# EAGLE design power electronics8 (EAGLE 9.2.2)
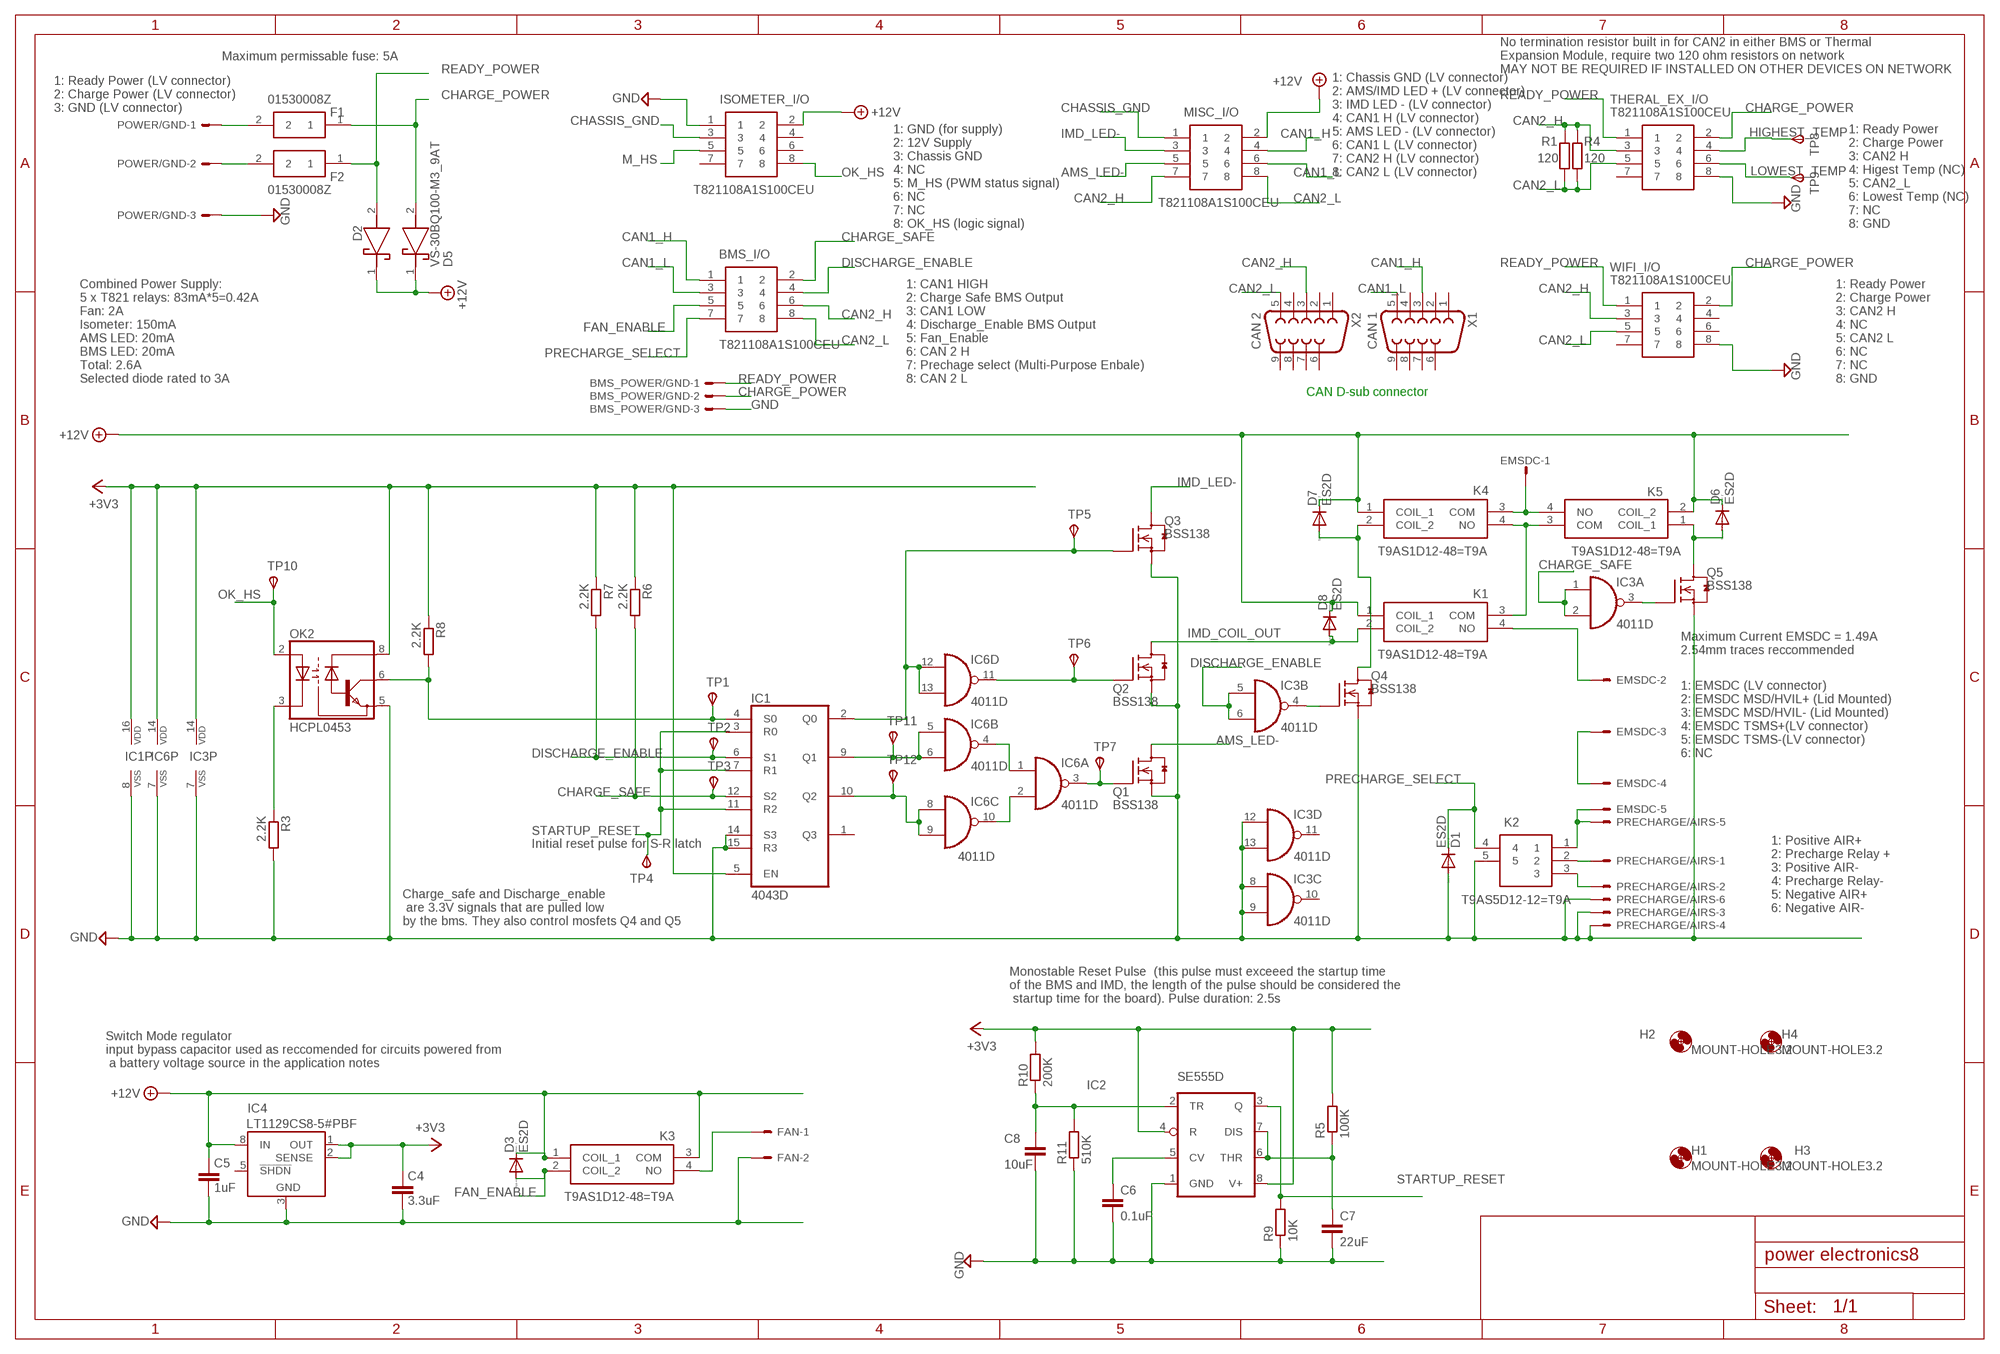
[diagram p0: schematic, sheet 1]

## Parts
BMS_I/O  T821108A1S100CEU  [HDRV8W64P254_2X4_1778X895X915P]
BMS_POWER/GND  KK-156-3  [KK-156-3]
C4  3.3uF  C-EUC1206  [C1206]
C5  1uF  C-EUC1206  [C1206]
C6  0.1uF  C-EUC1206  [C1206]
C7  22uF  C-EUC1206  [C1206]
C8  10uF  C-EUC1206  [C1206]
D1  ES2D  [SMB]
D2  VS-30BQ100-M3_9AT  [DIOM7959X262N]
D3  ES2D  [SMB]
D5  VS-30BQ100-M3_9AT  [DIOM7959X262N]
D6  ES2D  [SMB]
D7  ES2D  [SMB]
D8  ES2D  [SMB]
EMSDC  KK-156-6  [KK-156-6]
F1  01530008Z  [01530008]
F2  01530008Z  [01530008]
FAN  KK-156-2  [KK-156-2]
H1  MOUNT-HOLE3.2  [3,2]
H2  MOUNT-HOLE3.2  [3,2]
H3  MOUNT-HOLE3.2  [3,2]
H4  MOUNT-HOLE3.2  [3,2]
IC1  4043D  [SO16]
IC2  SE555D  [SO08]
IC3  4011D  [SO14]
IC4  LT1129CS8  [SOIC8]
IC6  4011D  [SO14]
ISOMETER_I/O  T821108A1S100CEU  [HDRV8W64P254_2X4_1778X895X915P]
K1  T9AS1D12-48=T9A  [T9AS1D1248T9A]
K2  T9AS5D12-12=T9A  [T9AS1D12]
K3  T9AS1D12-48=T9A  [T9AS1D1248T9A]
K4  T9AS1D12-48=T9A  [T9AS1D1248T9A]
K5  T9AS1D12-48=T9A  [T9AS1D1248T9A]
MISC_I/O  T821108A1S100CEU  [HDRV8W64P254_2X4_1778X895X915P]
OK2  HCPL0453  [SOIC08]
POWER/GND  KK-156-3  [KK-156-3]
PRECHARGE/AIRS  KK-156-6  [KK-156-6]
Q1  BSS138  [SOT23]
Q2  BSS138  [SOT23]
Q3  BSS138  [SOT23]
Q4  BSS138  [SOT23]
Q5  BSS138  [SOT23]
R1  120  R-EU_R1206  [R1206]
R3  2.2K  R-EU_R1206  [R1206]
R4  120  R-EU_R1206  [R1206]
R5  100K  R-EU_R1206  [R1206]
R6  2.2K  R-EU_R1206  [R1206]
R7  2.2K  R-EU_R1206  [R1206]
R8  2.2K  R-EU_R1206  [R1206]
R9  10K  R-EU_R1206  [R1206]
R10  200K  R-EU_R1206  [R1206]
R11  510K  R-EU_R1206  [R1206]
THERAL_EX_I/O  T821108A1S100CEU  [HDRV8W64P254_2X4_1778X895X915P]
TP1  TPSTP11R  [TP11R]
TP2  TPSTP11R  [TP11R]
TP3  TPSTP11R  [TP11R]
TP4  TPSTP11R  [TP11R]
TP5  TPSTP11R  [TP11R]
TP6  TPSTP11R  [TP11R]
TP7  TPSTP11R  [TP11R]
TP8  TPSTP11R  [TP11R]
TP9  TPSTP11R  [TP11R]
TP10  TPSTP11R  [TP11R]
TP11  TPSTP11R  [TP11R]
TP12  TPSTP11R  [TP11R]
WIFI_I/O  T821108A1S100CEU  [HDRV8W64P254_2X4_1778X895X915P]
X1  CAN 1  F09V  [F09V]
X2  CAN 2  F09V  [F09V]

## Nets
+3V3: C4.1 IC1.5(EN) IC1.16(VDD) IC2.4(R) IC2.8(V+) IC3.14(P:VDD) IC4.1(OUT) IC4.2(SENSE) IC6.14(P:VDD) OK2.8(VCC) R5.2 R6.1 R7.1 R8.1 R10.2
+12V [power]: C5.1 D2.1(K) D3.C D5.1(K) D6.C D7.C D8.C IC4.8(IN) ISOMETER_I/O.2 K1.1(COIL_1) K3.1(COIL_1) K3.3(COM) K4.1(COIL_1) K5.2(COIL_2) MISC_I/O.2
AMS_LED-: MISC_I/O.5 Q1.3(D)
CAN1_H: BMS_I/O.1 MISC_I/O.4 X1.3
CAN1_L: BMS_I/O.3 MISC_I/O.6 X1.5
CAN2_H: BMS_I/O.6 MISC_I/O.7 R1.1 R4.1 THERAL_EX_I/O.3 WIFI_I/O.3 X2.3
CAN2_L: BMS_I/O.8 MISC_I/O.8 R1.2 R4.2 THERAL_EX_I/O.5 WIFI_I/O.5 X2.5
CHARGE_POWER [power]: BMS_POWER/GND.2 D5.2(A) F1.1 THERAL_EX_I/O.2 WIFI_I/O.2
CHARGE_SAFE: BMS_I/O.2 IC1.12(S2) IC3.1(A:I0) IC3.2(A:I1) R6.2 TP3.TP(PP)
CHASSIS_GND [GND]: ISOMETER_I/O.3 MISC_I/O.1
DISCHARGE_ENABLE: BMS_I/O.4 IC1.6(S1) IC3.5(B:I0) IC3.6(B:I1) R7.2 TP2.TP(PP)
EMSDC_IMD+ [EMSDC]: K1.3(COM) K4.4(NO) K5.3(COM)
FAN+ [power]: FAN.1 K3.4(NO)
FAN_ENABLE: BMS_I/O.5 D3.A K3.2(COIL_2)
GND [GND]: BMS_POWER/GND.3 C4.2 C5.2 C6.2 C7.2 C8.2 D1.A FAN.2 IC1.8(VSS) IC1.14(S3) IC1.15(R3) IC2.1(GND) IC3.7(P:VSS) IC3.8(C:I0) IC3.9(C:I1) IC3.12(D:I0) IC3.13(D:I1) IC4.3(GND) IC6.7(P:VSS) ISOMETER_I/O.1 K2.5 OK2.5(GND) POWER/GND.3 PRECHARGE/AIRS.3 PRECHARGE/AIRS.4 PRECHARGE/AIRS.6 Q1.2(S) Q2.2(S) Q3.2(S) Q4.2(S) Q5.2(S) R3.2 R9.1 R11.1 THERAL_EX_I/O.8 WIFI_I/O.8
HIGHEST_TEMP: THERAL_EX_I/O.4 TP8.TP(PP)
IMD_COIL_OUT: D8.A K1.2(COIL_2) Q2.3(D)
IMD_LED-: MISC_I/O.3 Q3.3(D)
LOWEST_TEMP: THERAL_EX_I/O.6 TP9.TP(PP)
M_HS: ISOMETER_I/O.5
N$1 [EMSDC]: EMSDC.1 K4.3(COM) K5.4(NO)
N$2 [power]: F2.2 POWER/GND.2
N$3 [EMSDC]: K2.2 PRECHARGE/AIRS.1
N$4 [power]: F1.2 POWER/GND.1
N$5: IC1.4(S0) OK2.6(VO) R8.2 TP1.TP(PP)
N$6 [GND]: D7.A K4.2(COIL_2) Q4.3(D)
N$7: OK2.3(C) R3.1
N$8: IC1.2(Q0) IC6.12(D:I0) IC6.13(D:I1) Q3.1(G) TP5.TP(PP)
N$9 [GND]: D6.A K5.1(COIL_1) Q5.3(D)
N$10: IC1.9(Q1) IC6.5(B:I0) IC6.6(B:I1) TP11.TP(PP)
N$11 [EMSDC]: EMSDC.5 K2.1 PRECHARGE/AIRS.5
N$12 [EMSDC]: K2.3 PRECHARGE/AIRS.2
N$13: IC1.10(Q2) IC6.8(C:I0) IC6.9(C:I1) TP12.TP(PP)
N$14: IC6.1(A:I0) IC6.4(B:O)
N$15 [EMSDC]: EMSDC.2 K1.4(NO)
N$16: IC3.4(B:O) Q4.1(G)
N$17: C7.1 IC2.6(THR) IC2.7(DIS) R5.1
N$18: IC3.3(A:O) Q5.1(G)
N$19 [EMSDC]: EMSDC.3 EMSDC.4
N$20: IC6.2(A:I1) IC6.10(C:O)
N$21: IC6.3(A:O) Q1.1(G) TP7.TP(PP)
N$28: C8.1 IC2.2(TR) R10.1 R11.2
N$32: C6.1 IC2.5(CV)
N$37: IC6.11(D:O) Q2.1(G) TP6.TP(PP)
OK_HS: ISOMETER_I/O.8 OK2.2(A) TP10.TP(PP)
PRECHARGE_SELECT: BMS_I/O.7 D1.C K2.4
READY_POWER [power]: BMS_POWER/GND.1 D2.2(A) F2.1 THERAL_EX_I/O.1 WIFI_I/O.1
STARTUP_RESET: IC1.3(R0) IC1.7(R1) IC1.11(R2) IC2.3(Q) R9.2 TP4.TP(PP)
Unconnected: EMSDC.6 IC1.1(Q3) IC3.10(C:O) IC3.11(D:O) IC4.4(NC) IC4.5(!SHDN) ISOMETER_I/O.4 ISOMETER_I/O.6 ISOMETER_I/O.7 THERAL_EX_I/O.7 WIFI_I/O.4 WIFI_I/O.6 WIFI_I/O.7 X1.1 X1.2 X1.4 X1.6 X1.7 X1.8 X1.9 X2.1 X2.2 X2.4 X2.6 X2.7 X2.8 X2.9

## Notes on the sheet
- Maximum permissable fuse: 5A
- No termination resistor built in for CAN2 in either BMS or Thermal
  Expansion Module, require two 120 ohm resistors on network
  MAY NOT BE REQUIRED IF INSTALLED ON OTHER DEVICES ON NETWORK
- 1: Ready Power (LV connector)
  2: Charge Power (LV connector)
  3: GND (LV connector)
- 1: Chassis GND (LV connector)
  2: AMS/IMD LED + (LV connector)
  3: IMD LED - (LV connector)
  4: CAN1 H (LV connector)
  5: AMS LED - (LV connector)
  6: CAN1 L (LV connector)
  7: CAN2 H (LV connector)
  8: CAN2 L (LV connector)
- 1: GND (for supply) 
  2: 12V Supply
  3: Chassis GND 
  4: NC 
  5: M_HS (PWM status signal)
  6: NC
  7: NC
  8: OK_HS (logic signal)
- 1: Ready Power
  2: Charge Power
  3: CAN2 H
  4: Higest Temp (NC)
  5: CAN2_L
  6: Lowest Temp (NC)
  7: NC
  8: GND
- Combined Power Supply:
  5 x T821 relays: 83mA*5=0.42A
  Fan: 2A
  Isometer: 150mA
  AMS LED: 20mA
  BMS LED: 20mA
  Total: 2.6A
  Selected diode rated to 3A
- 1: CAN1 HIGH
  2: Charge Safe BMS Output 
  3: CAN1 LOW
  4: Discharge_Enable BMS Output
  5: Fan_Enable
  6: CAN 2 H
  7: Prechage select (Multi-Purpose Enbale)
  8: CAN 2 L
- 1: Ready Power
  2: Charge Power
  3: CAN2 H
  4: NC
  5: CAN2 L
  6: NC
  7: NC
  8: GND
- CAN D-sub connector
- Maximum Current EMSDC = 1.49A
  2.54mm traces reccommended
- 1: EMSDC (LV connector)
  2: EMSDC MSD/HVIL+ (Lid Mounted)
  3: EMSDC MSD/HVIL- (Lid Mounted)
  4: EMSDC TSMS+(LV connector)
  5: EMSDC TSMS-(LV connector)
  6: NC
- Initial reset pulse for S-R latch
- 1: Positive AIR+
  2: Precharge Relay +
  3: Positive AIR-
  4: Precharge Relay-
  5: Negative AIR+
  6: Negative AIR-
- Charge_safe and Discharge_enable
   are 3.3V signals that are pulled low 
  by the bms. They also control mosfets Q4 and Q5
- Monostable Reset Pulse  (this pulse must exceeed the startup time 
  of the BMS and IMD, the length of the pulse should be considered the
   startup time for the board). Pulse duration: 2.5s
- Switch Mode regulator
  input bypass capacitor used as reccomended for circuits powered from
   a battery voltage source in the application notes

## Power pins joined to a net without a drawn wire
GND: IC4.6(GND) IC4.7(GND)

## Library data of the parts
BMS_I/O ISOMETER_I/O MISC_I/O THERAL_EX_I/O WIFI_I/O = SamacSys_Parts:T821108A1S100CEU: HEADER, VERTICAL, 2.54MM, 8WAY Amphenol T821 Series, 2.54mm Pitch 8 Way 2 Row Straight PCB Header, Solder Termination, 3A Source: Datasheet <http://uk.rs-online.com/web/p/products/8323569>; DESCRIPTION: HEADER, VERTICAL, 2.54MM, 8WAY Amphenol T821 Series, 2.54mm Pitch 8 Way 2 Row Straight PCB Header, Solder Termination, 3A; HEIGHT: 9.15mm; MANUFACTURER_NAME: Amphenol; MANUFACTURER_PART_NUMBER: T821108A1S100CEU; RS_PART_NUMBER: 8323569; RS_PRICE-STOCK: http://uk.rs-online.com/web/p/products/8323569
BMS_POWER/GND POWER/GND = con-molex:KK-156-3: KK 156 HEADER Source: http://www.molex.com/pdm_docs/sd/026604100_sd.pdf; MF: MOLEX; OC_FARNELL: unknown; OC_NEWARK: unknown
C4-C8 = rcl:C-EU: CAPACITOR, European symbol; SPICEPREFIX: C
D1 D3 D6-D8 = diode:ES2D: DIODE super fast rectifier, 2 A
D2 D5 = SamacSys_Parts:VS-30BQ100-M3_9AT: Vishay VS-30BQ100-M3/9AT SMT Schottky Diode, 100V 3A, 2-Pin DO-214AB Source: Datasheet <https://componentsearchengine.com/Datasheets/1/VS-30BQ100-M3_9AT.pdf>; DESCRIPTION: Vishay VS-30BQ100-M3/9AT SMT Schottky Diode, 100V 3A, 2-Pin DO-214AB; HEIGHT: 2.62mm; MANUFACTURER_NAME: Vishay; MANUFACTURER_PART_NUMBER: VS-30BQ100-M3/9AT; MOUSER_PART_NUMBER: 78-VS-30BQ100-M39AT; MOUSER_PRICE-STOCK: https://www.mouser.com/Search/Refine.aspx?Keyword=78-VS-30BQ100-M39AT
EMSDC PRECHARGE/AIRS = con-molex:KK-156-6: KK 156 HEADER Source: http://www.molex.com/pdm_docs/sd/026604100_sd.pdf; MF: MOLEX; OC_FARNELL: unknown; OC_NEWARK: unknown
F1 F2 = SamacSys_Parts:01530008Z: Mini fuseholder,15A 32V Littelfuse 15A PCB Mount Fuse Holder Automotive Fuse, 32 V Source: Datasheet <http://www.littelfuse.com/data/en/data_sheets/153_pcmount.pdf>; ALLIED_NUMBER: 70184304; DESCRIPTION: Mini fuseholder,15A 32V Littelfuse 15A PCB Mount Fuse Holder Automotive Fuse, 32 V; HEIGHT: mm; MANUFACTURER_NAME: LITTELFUSE; MANUFACTURER_PART_NUMBER: 01530008Z; RS_PART_NUMBER: 3607317; RS_PRICE-STOCK: https://uk.rs-online.com/web/p/products/3607317
FAN = con-molex:KK-156-2: KK 156 HEADER Source: http://www.molex.com/pdm_docs/sd/026604100_sd.pdf; MF: MOLEX; OC_FARNELL: unknown; OC_NEWARK: unknown
H1-H4 = holes:MOUNT-HOLE: MOUNTING HOLE with drill center marker
IC1 = 40xx:4043: Quad 3-state NOR R/S LATCH
IC2 = linear:*555: TIMER
IC3 IC6 = 40xx:4011: Quad 2-input NAND
IC4 = linear-technology:LT1129CS8: VOLTAGE REGULATOR with shutdown; MPN: LT1129CS8-5#PBF; OC_FARNELL: 1273576; OC_NEWARK: 57M2078
K1 K3-K5 = SamacSys_Parts:T9AS1D12-48=T9A: SPST-NO PCB Mount Non-Latching Relay Through Hole, 48V dc Source: Datasheet <http://uk.rs-online.com/web/p/products/6802534P>; DESCRIPTION: SPST-NO PCB Mount Non-Latching Relay Through Hole, 48V dc; HEIGHT: 20.4mm; MANUFACTURER_NAME: TE Connectivity; MANUFACTURER_PART_NUMBER: T9AS1D12-48=T9A; RS_PART_NUMBER: 6802534P; RS_PRICE-STOCK: http://uk.rs-online.com/web/p/products/6802534P
K2 = SamacSys_Parts:T9AS5D12-12=T9A: PCB Relay SPDT 30A 12Vdc,thru hole SPDT PCB Mount Non-Latching Relay Through Hole, 12V dc Source: Datasheet; ALLIED_NUMBER: R1111589; DESCRIPTION: PCB Relay SPDT 30A 12Vdc,thru hole SPDT PCB Mount Non-Latching Relay Through Hole, 12V dc; HEIGHT: mm; MANUFACTURER_NAME: TE Connectivity; MANUFACTURER_PART_NUMBER: T9AS5D12-12=T9A; RS_PART_NUMBER: 6802528; RS_PRICE-STOCK: https://uk.rs-online.com/web/p/products/6802528
OK2 = optocoupler:HCPL0453: HEWLETT PACKARD OPTO COUPLER; MF: AGILENT TECHNOLOGIES; MPN: HCPL-0453-000E; OC_FARNELL: 1505123; OC_NEWARK: 88H7766
Q1-Q5 = m-pad-2.1:BSS138: Fairchild Semiconductors BSS138 N-Channel Logic Level Enhancement Mode Field Effect Transistor General Description: These N-Channel enhancement mode field effect transistors are produced using Fairchild's proprietary, high cell density, DMOS technology. These products have been designed to minimize on-state resistance while provide rugged, reliable, and fast switching performance.These products are particularly suited for low voltage, low current applications such as small servo motor control, power MOSFET gate drivers, and other switching applications. Features: 0.22 A, 50 V. RDS(ON) = 3.5Ohm @ VGS = 10 V RDS(ON) = 6.0Ohm @ VGS = 4.5 V High density cell design for extremely low RDS(ON) Rugged and Reliable Compact industry standard SOT-23 surface mount package Please send any comments to: messi@users.sourceforge.net
R1 R3-R11 = rcl:R-EU_: RESISTOR, European symbol; SPICEPREFIX: R
TP1-TP12 = testpad:TPS: TEST PIN
X1 X2 = con-subd:F09: SUB-D; OC_FARNELL: unknown; OC_NEWARK: unknown

## Net classes
0 default: width 0.508 mm
1 GND: width 0.889 mm
2 EMSDC: width 2.54 mm
3 power: width 0.889 mm

## Board
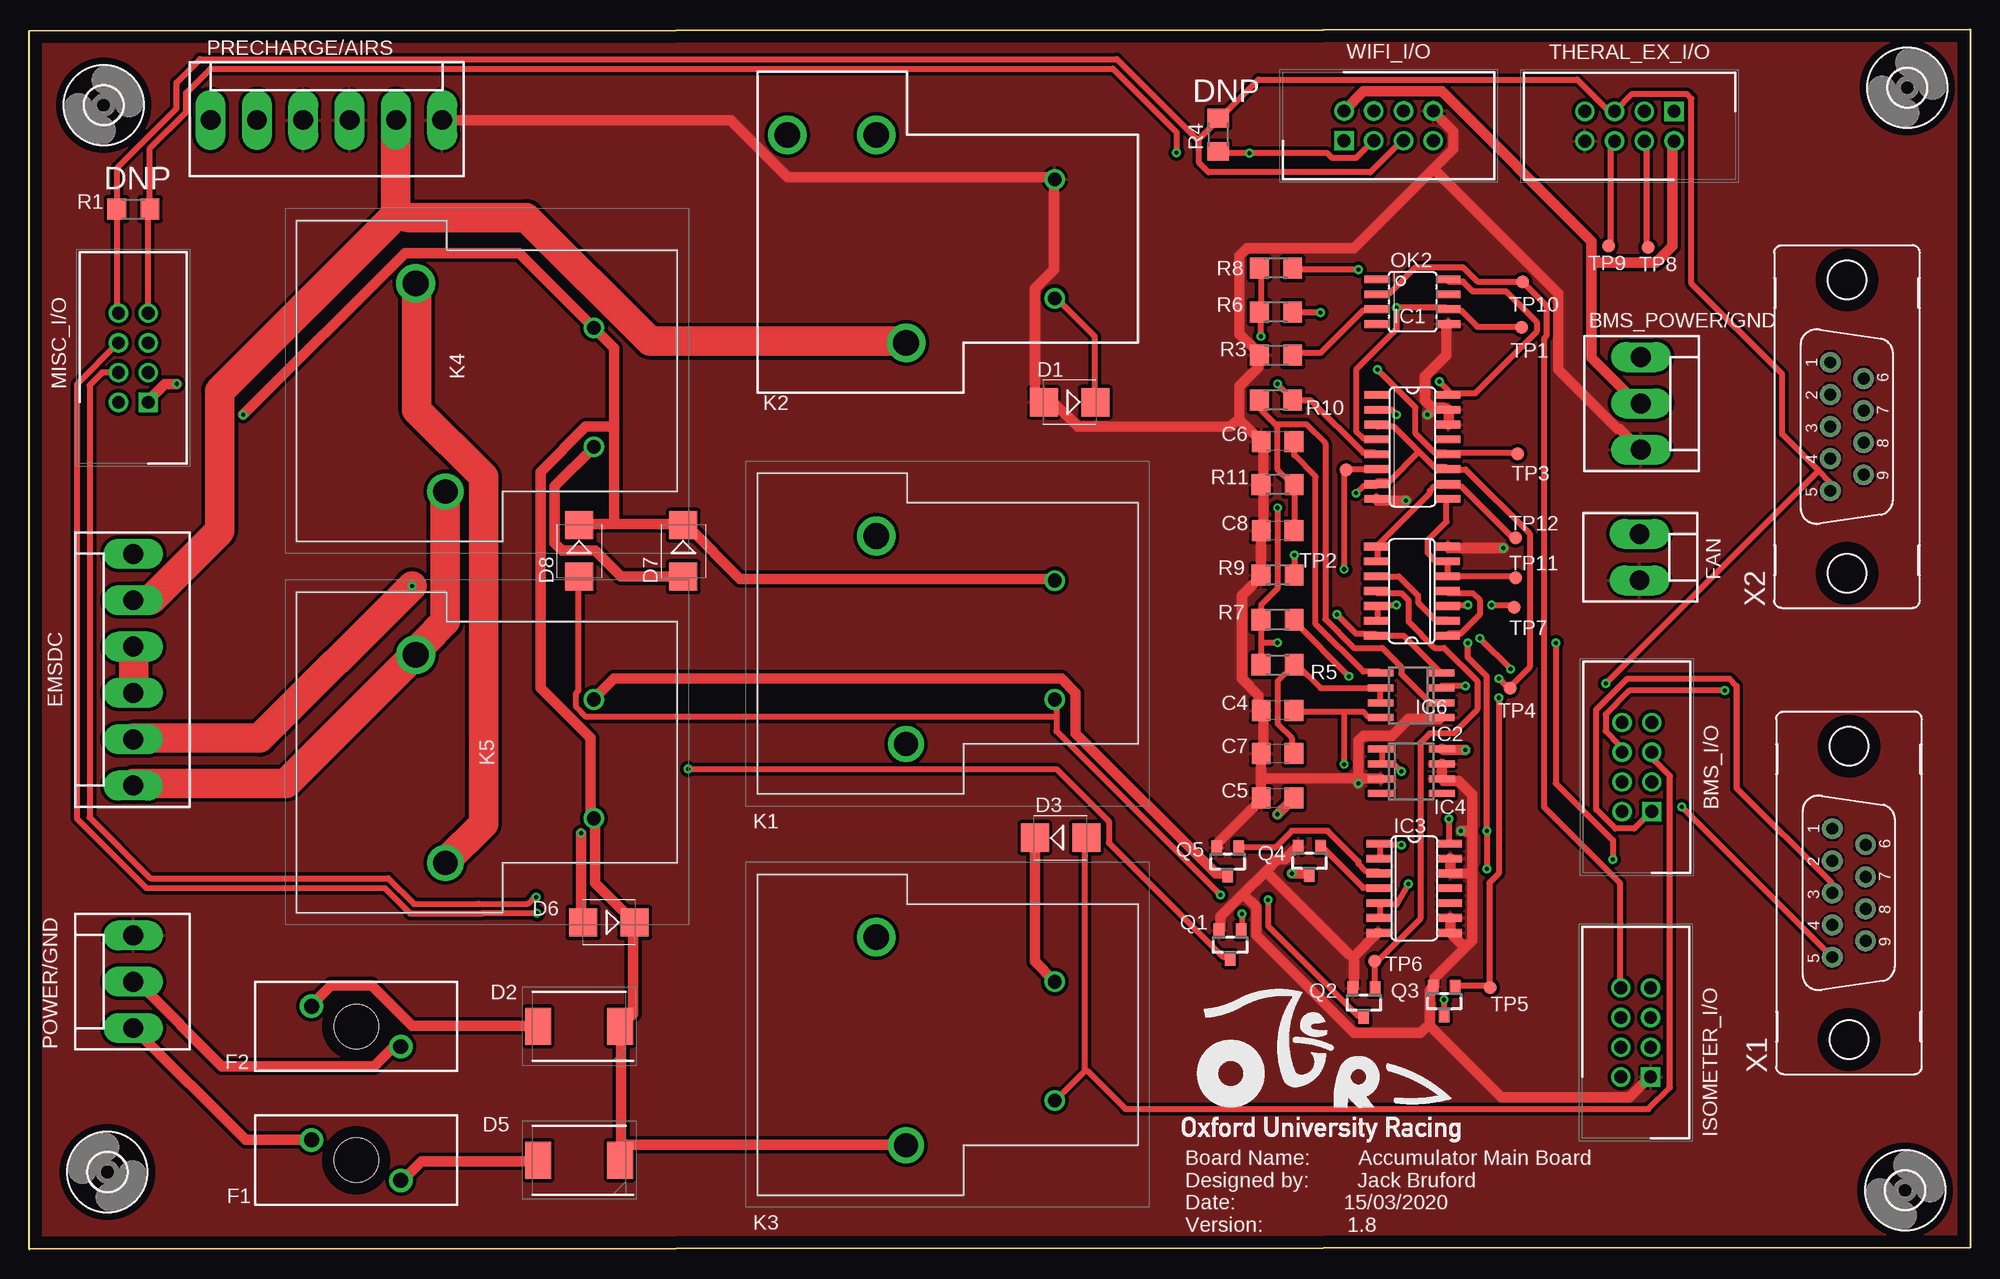
[diagram p1: board, top side]
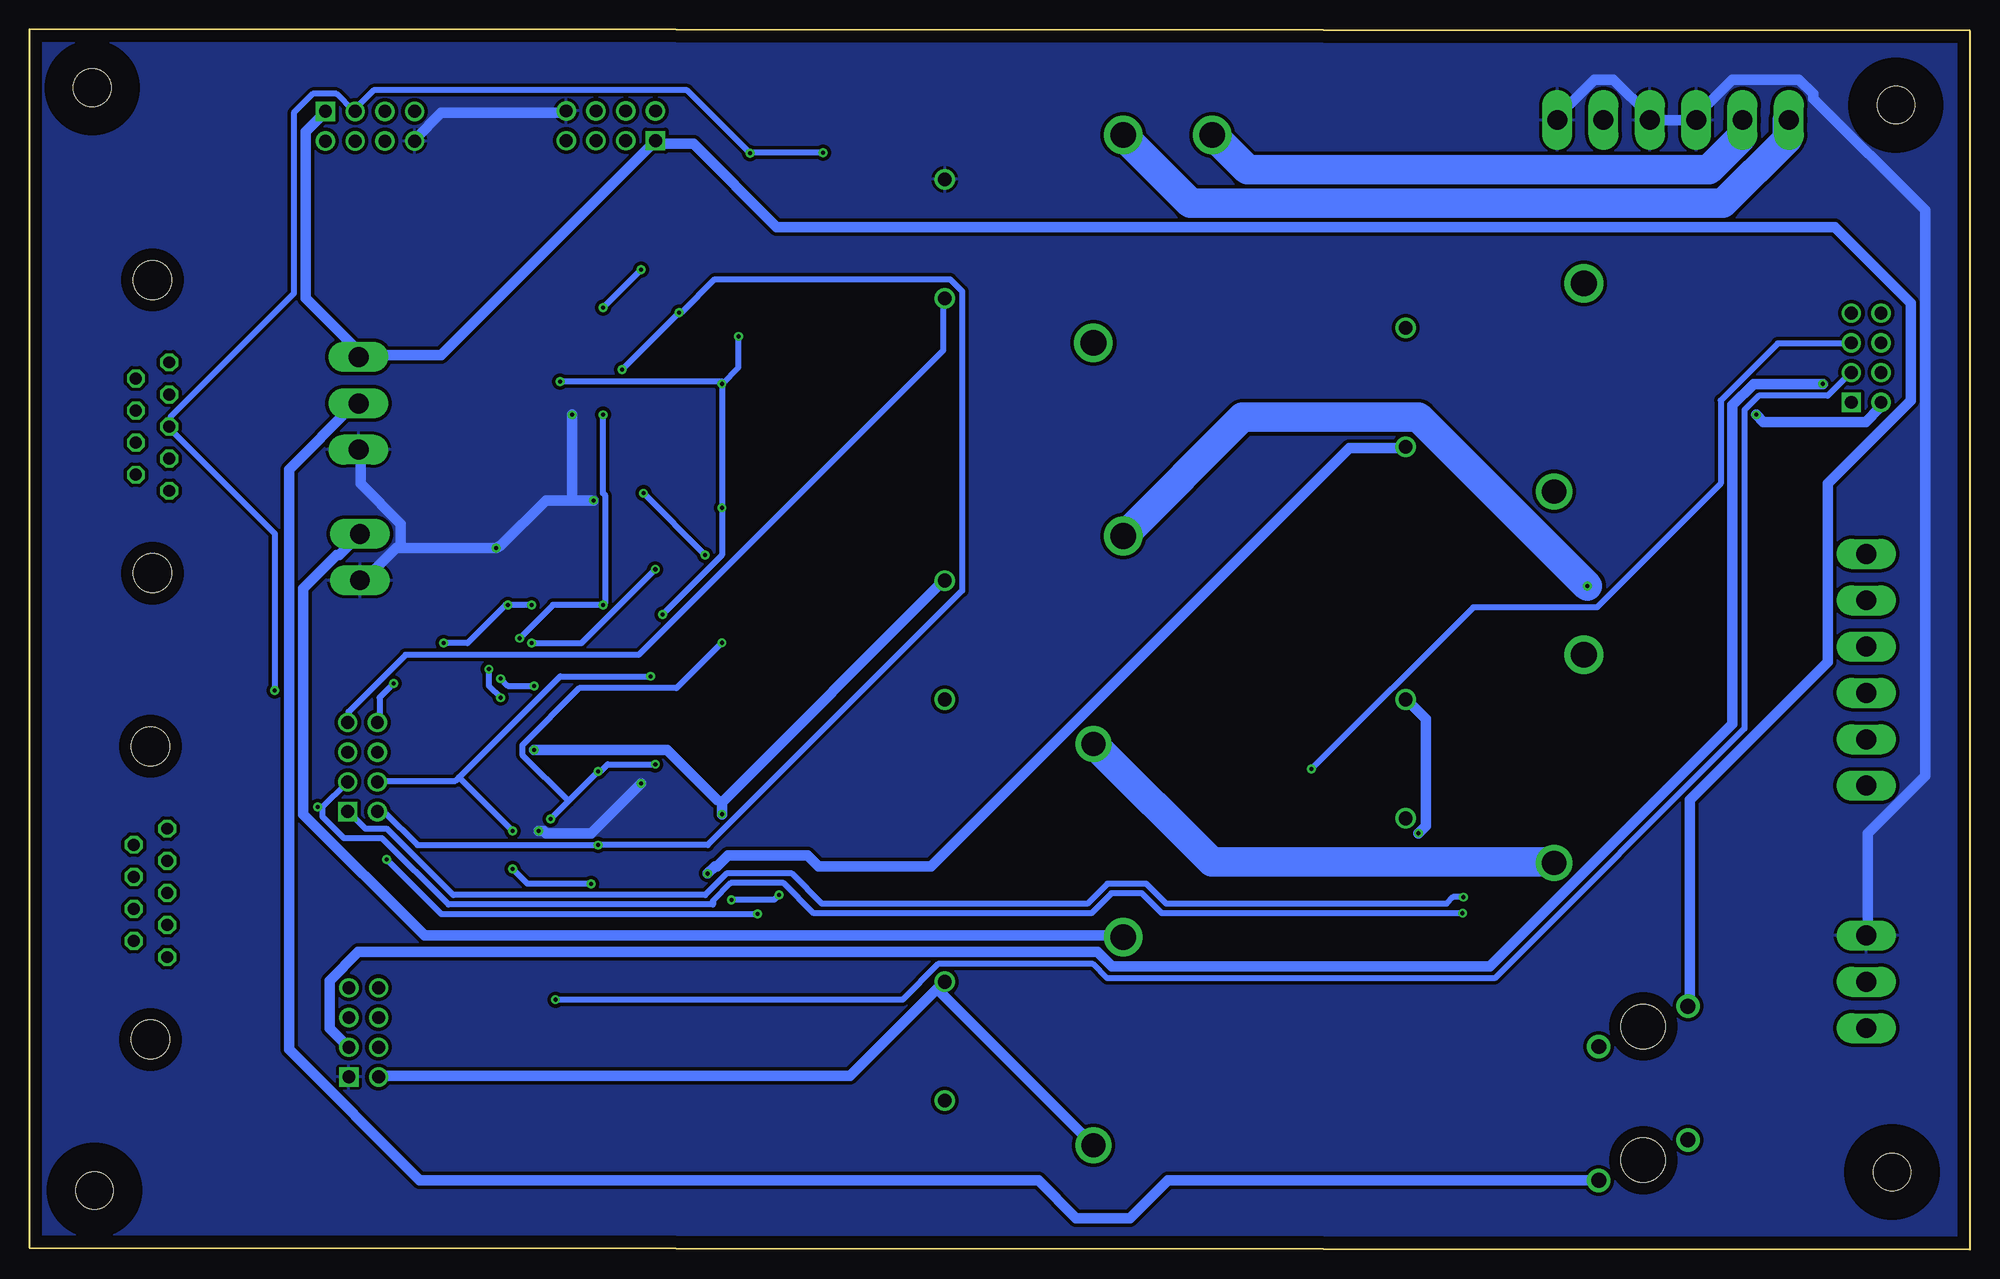
[diagram p2: board, bottom side, seen from below]

Size 165.87 x 104.27 mm. Coordinates in mm from the lower left corner, seen from the top.
Outline: 0,0 0,104.14 165.87,104.27 165.87,0.13 0,0
Copper layers (1*16): Top 0.035mm / dielectric 1.5mm / Bottom 0.035mm
Design rules "default *": minimum track width 6mil, minimum drill 0.35mm, track to track 12mil, track to pad 12mil, pad to pad 12mil, via to via 12mil, smd to smd 0mil, copper to edge 40mil, drill to drill 6mil, minimum pad ring 10mil, minimum via ring 8mil, stop-mask expansion 4mil, vias tented up to drill 0mil, thermal gap 10mil

### Footprints (pad centres in the part's own frame; a part is rotated, then mirrored left to right if it is on the bottom)
HDRV8W64P254_2X4_1778X895X915P = drill 1.1 pad 1.65 square: 1 0,0 | drill 1.1 pad 1.65: 2 0,2.54; 3 2.54,0; 4 2.54,2.54; 5 5.08,0; 6 5.08,2.54; 7 7.62,0; 8 7.62,2.54
KK-156-3 = drill 1.7 pad 2.184 long: 1 -3.96,0; 2 0,0; 3 3.96,0
C1206 = smd 1.6 x 1.8: 1 -1.4,0; 2 1.4,0
SMB = smd 2.4 x 2.4: A 2.2,0; C -2.2,0
DIOM7959X262N = smd 2.2 x 3.15: 1 -3.5,0; 2 3.5,0
KK-156-6 = drill 1.7 pad 2.184 long: 1 -9.9,0; 2 -5.94,0; 3 -1.98,0; 4 1.98,0; 5 5.94,0; 6 9.9,0
01530008 = drill 1.27 pad 2: 1 1.727,3.81; 2 -1.727,-3.81 | hole 3.785: 0,0
KK-156-2 = drill 1.7 pad 2.184 long: 1 -1.98,0; 2 1.98,0
3,2 = hole 3.2: 0,0
SO16 = smd 0.66 x 2.032: 1 -4.445,-3.073; 2 -3.175,-3.073; 3 -1.905,-3.073; 4 -0.635,-3.073; 5 0.635,-3.073; 6 1.905,-3.073; 7 3.175,-3.073; 8 4.445,-3.073; 9 4.445,3.073; 10 3.175,3.073; 11 1.905,3.073; 12 0.635,3.073; 13 -0.635,3.073; 14 -1.905,3.073; 15 -3.175,3.073; 16 -4.445,3.073
SO08 = smd 0.6 x 2.2: 1 -1.905,-2.6; 2 -0.635,-2.6; 3 0.635,-2.6; 4 1.905,-2.6; 5 1.905,2.6; 6 0.635,2.6; 7 -0.635,2.6; 8 -1.905,2.6
SO14 = smd 0.66 x 2.032: 1 -3.81,-3.073; 2 -2.54,-3.073; 3 -1.27,-3.073; 4 0,-3.073; 5 1.27,-3.073; 6 2.54,-3.073; 7 3.81,-3.073; 8 3.81,3.073; 9 2.54,3.073; 10 1.27,3.073; 11 0,3.073; 12 -1.27,3.073; 13 -2.54,3.073; 14 -3.81,3.073
SOIC8 = smd 0.6 x 2.2: 1 -1.905,-2.6; 2 -0.635,-2.6; 3 0.635,-2.6; 4 1.905,-2.6; 5 1.905,2.6; 6 0.635,2.6; 7 -0.635,2.6; 8 -1.905,2.6
T9AS1D1248T9A = drill 1.17 pad 1.755: 1 0,0; 2 -10.16,0 | drill 2.06 pad 3.09: 3 -13.97,12.7 | drill 2.19 pad 3.3: 4 3.81,15.24
T9AS1D12 = drill 2.19 pad 3.29: 1 -8.89,12.7; 2 8.89,15.24; 3 8.89,22.86 | drill 1.17 pad 1.77: 4 -5.08,0; 5 5.08,0
SOIC08 = smd 0.66 x 2.032: 1 -1.905,-3.073; 2 -0.635,-3.073; 3 0.635,-3.073; 4 1.905,-3.073; 5 1.905,3.073; 6 0.635,3.073; 7 -0.635,3.073; 8 -1.905,3.073
SOT23 = smd 0.9 x 1.2: 1 -0.95,-1.2; 2 0.95,-1.2; 3 0,1.2
R1206 = smd 1.6 x 1.803: 1 -1.422,0; 2 1.422,0
TP11R = smd 1.1 x 1.1: TP 0,0
F09V = drill 1.016 octagon: 1 5.486,1.422; 2 2.743,1.422; 3 0,1.422; 4 -2.743,1.422; 5 -5.486,1.422; 6 4.115,-1.422; 7 1.372,-1.422; 8 -1.372,-1.422; 9 -4.115,-1.422 | hole 3.302: -12.522,0; 12.522,0

### Placement (x,y rotation side)
BMS_I/O  138.65,37.41 90 top
BMS_POWER/GND  137.73,72.29 270 top
C4  106.68,46.06 180 top
C5  106.68,38.56 180 top
C6  106.68,69.04 180 top
C7  106.68,42.37 180 top
C8  106.68,61.42 180 top
D1  88.9,72.39 180 top
D2  46.99,19.05 180 top
D3  88.14,35.18 0 top
D5  46.99,7.62 180 top
D6  49.53,27.94 180 top
D7  55.88,59.69 270 top
D8  46.99,59.69 270 top
EMSDC  8.89,49.53 90 top
F1  27.94,7.62 270 top
F2  27.94,19.05 90 top
FAN  137.61,59.16 270 top
H1  160.3,5.04 0 top
H2  160.49,99.28 0 top
H3  6.68,6.6 90 top
H4  6.35,97.79 0 top
IC1  118.21,68.58 270 top
IC2  118.09,47.34 90 top
IC3  118.36,30.85 270 top
IC4  118.11,40.85 270 top
IC6  118.15,56.25 90 top
ISOMETER_I/O  138.56,14.73 90 top
K1  87.63,57.15 90 top
K2  87.63,86.36 90 top
K3  87.63,22.86 90 top
K4  48.26,78.74 90 top
K5  48.26,46.99 90 top
MISC_I/O  10.16,72.39 90 top
OK2  118.21,80.98 270 top
POWER/GND  8.89,22.86 90 top
PRECHARGE/AIRS  25.4,96.52 0 top
Q1  102.62,26.04 180 top
Q2  114.05,21.08 180 top
Q3  120.9,21.21 180 top
Q4  109.39,33.2 180 top
Q5  102.41,33.14 180 top
R1  8.89,88.9 180 top
R3  106.55,76.41 180 top
R4  101.6,95.25 90 top
R5  106.68,49.96 180 top
R6  106.55,80.09 0 top
R7  106.68,53.8 0 top
R8  106.55,83.84 0 top
R9  106.68,57.61 0 top
R10  106.55,72.56 0 top
R11  106.68,65.36 0 top
THERAL_EX_I/O  140.56,97.26 180 top
TP1  127.54,78.78 0 top
TP2  112.53,66.64 0 top
TP3  127.17,67.99 0 top
TP4  126.53,47.97 0 top
TP5  124.84,22.38 0 top
TP6  114.97,24.63 0 top
TP7  126.88,54.89 0 top
TP8  138.34,85.63 0 top
TP9  134.97,85.76 0 top
TP10  127.64,82.69 0 top
TP11  127,57.4 0 top
TP12  127,60.81 0 top
WIFI_I/O  112.36,94.75 0 top
X1  [F09V]  155.51,30.46 90 top
X2  [F09V]  155.33,70.31 90 top

### Tracks (layer width: path | path; a pad name or v marks a point on that pad's centre or on a via)
+3V3  (via drill 0.35)
  Top 0.508: 112.37,45.92 114,45.92 114.4,45.52 115.42,45.52 IC2.8 | 112.37,45.92 108.1,45.92 C4.1 | v121.31,36.78 121.31,34.75 IC3.14 | v117.25,40.84 116.64,41.45 115.62,41.45 IC4.2 115.62,41.66 115.62,42.67 IC4.1 | v112.37,41.45 112.37,45.92 | 121.31,73.15 123.55,73.15 128.83,78.44 128.83,79.25 126.19,81.89 123.34,81.89 122.53,82.7 121.31,82.7 OK2.8 | 121.31,73.15 IC1.16 | IC2.4 120.5,49.38 117.45,52.43 115.21,52.43 IC6.14 115.01,52.63 113.39,52.63 v111.76,54.25 | 105.26,51.84 105.26,53.65 R7.1 105.26,54.05 105.26,55.07 106.68,56.49 v106.68,63.37 | 105.26,51.84 105.26,49.99 R5.2 | R8.1 105.26,83.72 105.26,80.26 R6.1 105.26,79.86 v105.26,78.03 | IC1.5 115.01,68.07 114,68.07 109.53,72.54 108.1,72.54 R10.2 107.9,72.75 v106.68,73.97 | v120.5,74.17 121.31,73.36 121.31,73.15 | 105.26,51.84 v106.68,51.84
  Bottom 0.508: 119.79,38.3 v117.25,40.84 117.04,40.84 116.43,41.45 v112.37,41.45 | 119.79,38.3 v121.31,36.78 | v105.26,78.03 105.26,75.39 v106.68,73.97 | v106.68,73.97 v106.68,63.37 106.68,59.33 v111.76,54.25 | v120.5,74.17 106.68,74.17 v106.68,73.97 | 119.79,38.3 123.75,42.27 123.75,43.08 118.87,47.95 110.57,47.95 v106.68,51.84
+12V  (via drill 0.35)
  Top 0.889: D3.C 85.95,35.15 85.95,24.59 87.58,22.96 K3.1 | K3.3 74.78,8.94 51,8.94 D5.1 50.6,7.72 50.6,18.69 D2.1 50.6,19.1 51.61,20.12 51.61,27.84 D6.C 51.41,28.25 48.36,31.29 48.36,36.78 K5.2 47.95,37.19 47.95,43.69 43.69,47.95 43.69,66.45 47.55,70.31 49.99,70.31 | v106.68,37.19 107.9,38.41 C5.1 | v122.73,42.67 120.9,42.67 IC4.8 | 49.99,61.98 55.88,61.98 D7.C 56.29,61.77 60.76,57.3 87.58,57.3 K1.1 | 49.99,61.98 47.14,61.98 D8.C | v18.29,71.32 32.11,85.14 41.86,85.14 K4.1 49.99,77.01 49.99,70.31 | 49.99,70.31 49.99,61.98
  Bottom 0.889: 88.29,22.25 87.78,22.76 K3.1 | 88.29,22.25 95.71,14.83 135.94,14.83 ISOMETER_I/O.2 | 88.29,22.25 K3.3 | 106.68,38.2 v106.68,37.19 | 106.68,38.2 87.78,57.1 K1.1 | v122.73,42.67 111.35,42.67 107.09,38.41 106.68,38.2 | v18.29,71.32 17.68,70.71 8.94,70.71 7.72,71.93 7.72,72.34 MISC_I/O.2
AMS_LED-  (via drill 0.35)
  Top 0.508: v56.29,41.05 87.78,41.05 92.25,36.58 92.25,34.75 102.01,24.99 102.62,24.99 Q1.3
  Bottom 0.508: v56.29,41.05 42.47,54.86 31.9,54.86 21.34,65.43 21.34,72.54 16.46,77.42 10.16,77.42 MISC_I/O.5
CAN1_H  (via drill 0.35)
  Top 0.508: X1.3 154.03,30.48 154.03,31.29 145.9,39.42 145.9,48.16 145.29,48.77 136.55,48.77 133.91,46.13 133.91,37.59 135.53,35.97 137.16,35.97 138.58,37.39 BMS_I/O.1 | MISC_I/O.4 6.23,74.93 5.15,73.85 5.15,36.9 10.34,31.7 30.69,31.7 32.87,29.52 38.37,29.52 38.4,29.54 42.62,29.54 43.18,30.1 v43.31,30.1
  Bottom 0.508: BMS_I/O.1 138.58,37.39 137.16,35.97 135.33,35.97 129.64,30.28 108.11,30.28 106.28,32.11 100.69,32.11 98.12,29.54 75.44,29.54 73.74,31.24 70.41,31.24 68.71,29.54 44.76,29.54 44.2,30.1 v43.31,30.1
CAN1_L  (via drill 0.35)
  Top 0.508: v141.22,37.8 154.03,24.99 X1.5 | MISC_I/O.6 4.06,73.91 4.06,36.83 10.01,30.89 30.35,30.89 32.54,28.7 38.71,28.7 38.73,28.73 v43.38,28.73
  Bottom 0.508: 140.82,37.8 v141.22,37.8 | 140.82,37.8 138.79,39.83 BMS_I/O.3 | v43.38,28.73 69.09,28.73 70.79,30.43 73.4,30.43 75.1,28.73 98.83,28.73 101.4,31.29 105.92,31.29 107.44,29.77 107.44,29.46 130.05,29.46 135.74,35.15 138.99,35.15 140.82,36.98 140.82,37.8
CAN2_H  (via drill 0.35)
  Top 0.508: v144.88,47.75 136.75,47.75 134.72,45.72 134.72,44.3 135.94,43.08 135.94,42.67 BMS_I/O.6 | MISC_I/O.7 10.16,88.8 R1.1 10.31,94.1 13.4,97.19 13.4,98.82 15.49,100.91 92.6,100.91 98.04,95.47 v98.04,93.73 | R4.1 101.6,93.67 v104.27,93.67 110.95,93.67 111.35,93.27 113.39,93.27 114.81,94.69 WIFI_I/O.3
  Bottom 0.508: 138.18,97.33 139.6,98.75 141.63,98.75 143.26,97.13 143.26,81.69 153.82,71.12 153.82,70.51 X2.3 153.82,70.1 144.88,61.16 v144.88,47.75 | 138.18,97.33 THERAL_EX_I/O.3 | v98.04,93.73 104.22,93.73 v104.27,93.67 109.65,99.06 136.45,99.06 138.18,97.33
CAN2_L  (via drill 0.35)
  Top 0.508: 152.91,66.55 149.8,69.66 149.8,74.79 142.04,82.55 142.04,98.35 141.63,98.75 136.96,98.75 135.53,97.33 THERAL_EX_I/O.5 135.33,97.33 134.93,97.33 132.28,99.97 105.05,99.97 101.8,96.72 R4.2 101.6,96.52 99.97,94.89 | 152.91,66.55 153.82,65.63 153.82,65.02 X2.5 | 152.91,66.55 v134.72,48.36 | MISC_I/O.8 7.52,80.06 7.52,88.8 R1.2 7.52,89 7.52,92.46 12.59,97.52 12.59,99.71 14.61,101.73 92.94,101.73 99.77,94.89 99.97,94.89 | 99.97,94.89 99.97,92.86 100.79,92.05 114.61,92.05 117.25,94.69 WIFI_I/O.5
  Bottom 0.508: v134.72,48.36 135.94,47.14 135.94,45.11 BMS_I/O.8
CHARGE_POWER
  Top 0.889: D5.2 43.48,7.52 33.53,7.52 31.9,5.89 F1.1 | 133.5,84.33 133.5,76.2 137.57,72.14 BMS_POWER/GND.2 | 133.5,84.33 133.5,86.16 120.7,98.96 114,98.96 112.37,97.33 WIFI_I/O.2 | 133.5,84.33 138.99,84.33 140.41,85.75 140.41,94.69 THERAL_EX_I/O.2
  Bottom 0.889: F1.1 68.58,5.89 71.81,2.67 76.4,2.67 79.63,5.89 132.49,5.89 143.66,17.07 143.66,66.65 138.18,72.14 137.77,72.14 BMS_POWER/GND.2
CHARGE_SAFE  (via drill 0.35)
  Top 0.508: IC3.2 115.42,33.53 115.42,34.54 IC3.1 115.62,34.54 v117.25,34.54 | TP3.TP 127,68.07 121.31,68.07 IC1.12 121.11,68.07 120.09,68.07 118.47,69.7 118.47,71.93 v115.21,75.18 | v110.34,80.06 108.1,80.06 R6.2
  Bottom 0.508: BMS_I/O.2 135.94,37.39 135.53,37.39 132.69,34.54 v117.25,34.54 107.9,34.54 86.16,56.29 86.16,81.89 87.17,82.91 107.29,82.91 110.13,80.06 v110.34,80.06 v115.21,75.18
CHASSIS_GND  (via drill 0.35)
  Top 0.889: v12.6,73.97 11.58,73.97 10.16,72.54 MISC_I/O.1
  Bottom 0.889: v12.6,73.97 18.49,73.97 20.32,72.14 20.32,44.91 41.05,24.18 73.36,24.18 74.57,25.4 137.77,25.4 140.21,22.96 140.21,18.9 138.58,17.27 ISOMETER_I/O.3
DISCHARGE_ENABLE  (via drill 0.35)
  Top 0.508: IC1.6 115.01,66.65 112.57,66.65 TP2.TP 112.37,66.45 v112.37,58.12 | IC3.6 115.42,28.45 115.42,29.46 IC3.5 115.62,29.46 116.84,29.46 v117.86,31.24 | v112.78,48.97 108.1,53.65 R7.2 | v124.56,32.51 v124.56,35.76 124.56,48.97 122.94,50.6 v122.94,51.82
  Bottom 0.508: v112.78,48.97 120.5,48.97 129.13,40.34 | 129.13,40.34 129.44,40.03 135.94,40.03 BMS_I/O.4 | v124.56,32.51 123.29,31.24 v117.86,31.24 | 129.13,40.34 v124.56,35.76 | v112.37,58.12 118.67,51.82 v122.94,51.82
EMSDC_IMD+
  Top 2.54: K4.4 33.12,82.5 33.12,71.73 38.81,66.04 38.81,36.37 35.56,33.12 K5.3
  Bottom 2.54: K5.3 35.56,33.12 64.82,33.12 74.78,43.08 K1.3
FAN+
  Bottom 0.889: FAN.1 137.77,60.96 139.4,59.33 139.6,59.33 142.44,56.49 142.44,37.19 132.08,26.82 72.54,26.82 K3.4
FAN_ENABLE
  Top 0.508: 90.22,15.24 90.22,35.15 D3.A | 90.22,15.24 87.78,12.8 K3.2 | BMS_I/O.5 138.79,42.47 138.79,41.86 140.21,40.44 140.21,13.82 138.38,11.99 93.67,11.99 90.42,15.24 90.22,15.24
GND  (via drill 0.35)
  Top 0.889: 113.18,24.99 113.18,22.35 Q2.2 | 113.18,24.99 115.21,27.03 IC3.7 | 105.66,32.31 106.68,33.33 107.29,33.33 108.31,34.34 Q4.2 | 105.66,32.31 103.73,30.38 | 103.73,30.38 101.8,28.45 101.8,27.43 Q1.2 | 105.66,32.31 112.78,25.2 113.18,24.99 | 122.76,25.83 123.34,26.42 123.34,32.13 | 122.76,25.83 120.09,23.16 120.09,22.55 Q3.2 119.69,22.15 119.69,19.1 | 123.34,35.76 123.34,38.81 122.12,40.03 120.9,40.03 IC4.6 120.7,40.64 120.7,41.45 IC4.7 | 123.34,35.76 123.34,32.13 | 119.69,19.1 125.78,13.01 136.75,13.01 138.38,14.63 ISOMETER_I/O.1 | 103.73,30.38 104.85,29.26 104.85,26.82 113.18,18.49 118.87,18.49 119.28,18.9 119.69,19.1 | IC1.14 121.31,70.51 121.31,71.73 IC1.15 120.9,71.93 119.89,71.93 | 119.89,71.93 119.28,72.54 119.28,74.57 121.11,76.4 121.11,79.05 OK2.5 | v125.98,59.94 121.31,59.94 IC6.7 | v117.65,64.01 115.21,64.01 IC1.8 | v119.48,71.32 119.69,71.53 119.89,71.93 | Q5.2 101.6,34.34 101.6,34.75 105.26,38.41 C5.2 105.26,39.01 105.26,40.23 | 105.26,40.23 105.26,42.27 C7.2 105.46,42.67 105.46,45.92 C4.2 105.05,46.33 105.05,47.35 103.63,48.77 103.63,55.88 105.05,57.3 R9.1 105.26,57.71 105.26,61.16 C8.2 105.46,61.57 105.46,65.23 R11.1 105.46,65.63 105.46,68.89 C6.2 105.05,69.29 103.43,70.92 | 105.26,40.23 113.59,40.23 | 113.59,40.23 115.42,40.23 IC4.3 | 113.59,40.23 113.59,43.48 114,43.89 116.43,43.89 117.86,45.31 120.5,45.31 IC2.1 | 103.43,70.92 103.43,73.76 105.05,75.39 105.05,76.4 R3.2 104.85,76.81 103.43,78.23 103.43,84.94 104.04,85.55 113.18,85.55 119.99,92.35 | 103.43,70.92 103.02,70.71 102.62,70.31 89.61,70.31 87.58,72.34 86.77,72.34 D1.A 86.56,72.75 85.95,73.36 85.95,82.09 87.58,83.72 87.58,91.44 K2.5 87.17,91.64 64.82,91.64 59.94,96.52 PRECHARGE/AIRS.6
  Top 0.889: 119.99,92.35 121.72,94.08 121.72,95.5 120.09,97.13 WIFI_I/O.8 | 119.99,92.35 130.66,81.69 130.66,75.18 135.74,70.1 135.94,70.1 137.57,68.48 BMS_POWER/GND.3 | v122.33,35.76 123.34,35.76 | v113.59,39.83 113.59,40.23 | IC3.9 IC3.8 122.64,25.83 122.76,25.83 | 123.34,32.13 IC3.12 IC3.13
  Bottom 0.889: POWER/GND.3 8.74,26.82 8.74,35.56 3.86,40.44 3.86,88.8 13.41,98.35 13.41,98.75 14.63,99.97 20.32,99.97 23.37,96.93 23.37,96.52 PRECHARGE/AIRS.3 PRECHARGE/AIRS.4 27.43,96.93 30.48,99.97 32.11,99.97 35.15,96.93 35.15,96.52 PRECHARGE/AIRS.6 | 134.11,59.94 134.52,59.94 137.16,57.3 137.57,57.3 FAN.2 | 134.11,59.94 v125.98,59.94 125.58,60.15 121.72,64.01 119.48,64.01 | 119.48,64.01 v117.65,64.01 | 134.11,59.94 134.11,61.98 137.57,65.43 137.57,68.28 BMS_POWER/GND.3 | 119.48,64.01 v119.48,71.32 | WIFI_I/O.8 120.09,97.13 130.66,97.13 132.89,94.89 THERAL_EX_I/O.8 | v122.33,35.76 121.92,35.76 121.72,35.56 117.86,35.56 v113.59,39.83
  pour Top: 165.86,104.27 165.86,0 0,0 0,104.14
  pour Bottom: 0,104.14 0,0.13 165.86,0.13 165.86,104.14
HIGHEST_TEMP
  Top 0.508: TP8.TP 138.18,85.75 138.18,94.69 THERAL_EX_I/O.4
IMD_COIL_OUT  (via drill 0.35)
  Top 0.508: v105.87,29.87 105.87,27.64 113.59,19.91 114,19.91 Q2.3 | v101.8,30.28 87.78,44.3 87.78,45.52 | 87.78,45.52 87.78,46.94 K1.2 | 87.78,45.52 47.55,45.52 46.74,46.33 46.74,47.55 46.94,47.75 46.94,57.3 D8.A
  Bottom 0.508: v105.87,29.87 102.21,29.87 v101.8,30.28
IMD_LED-  (via drill 0.35)
  Top 0.508: v120.9,21.34 Q3.3
  Bottom 0.508: v120.9,21.34 91.24,21.34 88.19,24.38 74.98,24.38 73.76,23.16 40.64,23.16 19.3,44.5 19.3,71.73 18.09,72.95 12.19,72.95 10.16,74.98 MISC_I/O.3
LOWEST_TEMP
  Top 0.508: TP9.TP 135.13,85.95 135.13,94.49 135.33,94.69 THERAL_EX_I/O.6
N$1
  Top 2.54: EMSDC.1 8.94,39.83 21.95,39.83 32.92,50.8 K5.4 33.73,51.82 35.56,53.65 K4.3
N$2
  Top 0.889: F2.2 31.7,17.27 31.09,17.27 29.46,15.65 16.46,15.65 9.35,22.76 8.94,22.76 POWER/GND.2
N$3
  Bottom 2.54: PRECHARGE/AIRS.1 15.65,96.52 15.65,94.89 21.13,89.41 66.65,89.41 72.34,95.1 K2.2
N$4
  Top 0.889: F1.2 18.49,9.35 8.94,18.9 POWER/GND.1
N$5  (via drill 0.35)
  Top 0.508: TP1.TP 127.41,78.84 123.75,78.84 122.33,80.26 121.31,80.26 OK2.6 121.11,80.47 v116.84,80.47 116.84,78.64 113.39,75.18 113.39,69.9 114,69.29 115.01,69.29 IC1.4 | v113.59,83.72 108.1,83.72 R8.2
  Bottom 0.508: v116.84,80.47 v113.59,83.72
N$6  (via drill 0.35)
  Top 0.889: v107.9,32.11 109.32,32.11 Q4.3 | K4.2 44.91,65.23 44.91,60.35 45.52,59.74 48.36,59.74 50.6,57.51 55.88,57.51 D7.A
  Bottom 0.889: K4.2 48.36,68.48 53.03,68.48 88.8,32.72 98.42,32.72 99.36,33.66 106.15,33.66 107.08,32.73 107.28,32.73 v107.9,32.11
N$7
  Top 0.508: R3.1 108.1,76.61 110.34,76.61 114,80.26 115.01,80.26 OK2.3
N$8  (via drill 0.35)
  Top 0.508: Q3.1 121.92,22.55 124.77,22.55 TP5.TP 124.77,22.76 124.77,31.29 125.58,32.11 v125.58,47.14 | IC6.13 115.21,53.85 115.21,54.86 IC6.12 115.21,55.07 v116.84,55.07 | v116.84,71.32 116.43,71.73 115.21,71.73 IC1.2 | v123.95,52.22 v126.59,49.58
  Bottom 0.508: v116.84,71.32 116.84,64.62 116.64,64.41 116.64,55.27 v116.84,55.07 121.11,55.07 v123.95,52.22 | v125.58,47.14 126.59,48.16 v126.59,49.58
N$9  (via drill 0.35)
  Top 0.889: Q5.3 102.21,32.11 101.4,32.11 89.41,44.09 89.41,47.55 88.19,48.77 49.99,48.77 48.36,47.14 K5.1 | v47.14,35.56 47.14,28.04 D6.A
  Bottom 0.889: v47.14,35.56 46.53,36.17 46.53,45.31 48.16,46.94 K5.1
N$10
  Top 0.508: TP11.TP 127,57.51 126.98,57.52 IC6.5 IC6.6 120.22,58.8 119.48,59.54 119.48,60.55 121.11,62.18 121.11,64.01 IC1.9
N$11
  Top 2.54: 31.29,88.39 16.26,73.36 16.26,61.37 10.36,55.47 8.94,55.47 EMSDC.5 | 31.29,88.39 31.29,96.52 PRECHARGE/AIRS.5 | K2.1 74.78,77.62 53.03,77.62 42.47,88.19 32.51,88.19 31.29,88.39
N$12
  Bottom 2.54: K2.3 61.77,92.25 22.35,92.25 19.51,95.1 19.51,96.52 PRECHARGE/AIRS.2
N$13
  Top 0.508: IC6.9 115.21,58.93 115.21,59.94 IC6.8 115.21,60.15 119.69,64.62 119.69,64.82 120.09,65.23 121.11,65.23 IC1.10 121.31,65.23 122.33,65.23 126.59,60.96 127,60.96 TP12.TP
N$14
  Top 0.508: IC6.1 121.31,52.63 122.33,52.63 123.95,54.25 123.95,55.47 123.34,56.08 121.31,56.08 IC6.4
N$15  (via drill 0.35)
  Top 2.54: v32.72,56.69 19.71,43.69 8.94,43.69 EMSDC.2
  Bottom 2.54: v32.72,56.69 47.14,71.12 62.18,71.12 72.34,60.96 K1.4
N$16
  Top 0.508: Q4.1 110.54,34.34 114,30.89 115.21,30.89 IC3.4
N$17
  Top 0.508: IC2.7 115.42,46.74 115.42,47.95 IC2.6 115.21,47.95 110.34,47.95 108.31,49.99 R5.1 107.9,49.78 106.68,48.56 106.68,44.91 107.9,43.69 107.9,42.47 C7.1
N$18
  Top 0.508: Q5.1 103.43,34.34 106.48,34.34 107.9,35.76 110.95,35.76 113.59,33.12 113.59,32.92 114.2,32.31 115.21,32.31 IC3.3
N$19
  Top 2.54: EMSDC.3 8.94,47.75 8.94,51.41 EMSDC.4
N$20
  Top 0.508: IC6.2 121.11,53.85 120.09,53.85 118.67,55.27 118.67,55.88 117.04,57.51 115.21,57.51 IC6.10
N$21  (via drill 0.35)
  Top 0.508: v124.97,55.07 126.8,55.07 TP7.TP | v122.94,55.07 121.31,55.07 IC6.3 | v103.63,28.65 103.63,27.43 Q1.1 | v135.33,33.33 135.33,34.95 130.45,39.83 v130.45,51.82
  Bottom 0.508: v122.94,55.07 v124.97,55.07 125.17,55.07 128.42,51.82 v130.45,51.82 | v103.63,28.65 130.66,28.65 v135.33,33.33
N$28
  Top 0.508: C8.1 108.1,61.57 108.1,65.23 R11.2 107.9,65.43 106.68,66.65 106.68,70.31 106.58,70.41 | 106.58,70.41 105.26,71.73 105.26,72.54 R10.1 | IC2.2 120.5,46.74 119.69,46.74 117.25,49.17 117.25,49.78 115.62,51.41 113.18,51.41 110.74,53.85 110.74,68.89 109.12,70.51 106.68,70.51 106.58,70.41
N$32
  Top 0.508: C6.1 108.1,68.89 108.1,67.87 109.93,66.04 109.93,53.44 114,49.38 115.42,49.38 IC2.5
N$37
  Top 0.508: Q2.1 115.01,22.35 115.01,24.59 TP6.TP 115.21,24.59 118.87,28.25 118.87,43.28 119.69,44.09 121.72,44.09 123.75,46.13 123.75,48.56 120.9,51.41 120.09,51.41 117.86,53.65 117.86,55.47 117.25,56.08 115.21,56.08 IC6.11
OK_HS
  Top 0.508: OK2.2 115.21,81.69 116.23,81.69 118.47,83.92 122.53,83.92 123.75,82.7 127.61,82.7 TP10.TP 127.81,82.5 129.64,80.67 129.64,78.03 129.44,77.83 129.44,37.8 135.94,31.29 135.94,22.35 ISOMETER_I/O.8
PRECHARGE_SELECT
  Top 0.508: D1.C 91.03,72.54 91.03,78.03 87.78,81.28 K2.4
  Bottom 0.508: BMS_I/O.7 138.58,45.11 138.58,45.92 133.71,50.8 113.79,50.8 87.78,76.81 87.78,81.28 K2.4
READY_POWER
  Top 0.889: D2.2 43.48,19.1 32.72,19.1 29.26,22.55 25.81,22.55 24.18,20.93 F2.1
  Bottom 0.889: THERAL_EX_I/O.1 140.61,97.13 142.24,95.5 142.24,81.28 137.77,76.81 BMS_POWER/GND.1 137.57,76.4 130.66,76.4 112.37,94.69 WIFI_I/O.1 111.96,94.49 109.12,94.49 102.01,87.38 11.58,87.38 5.08,80.87 5.08,72.54 12.19,65.43 12.19,50.19 23.98,38.41 23.98,20.93 F2.1
STARTUP_RESET  (via drill 0.35)
  Top 0.508: v108.1,59.33 108.1,57.71 R9.2 | v113.39,64.62 114,65.23 115.01,65.23 IC1.7 115.21,65.63 116.23,65.63 118.77,68.17 | 118.77,68.17 120.09,66.85 121.11,66.85 IC1.11 121.31,66.65 122.73,66.65 128.22,61.16 128.22,49.78 126.59,48.16 TP4.TP 126.39,47.95 v125.58,48.77 | 118.77,68.17 116.64,70.31 115.21,70.31 IC1.3 | v122.73,48.16 120.7,48.16 IC2.3
  Bottom 0.508: v113.39,64.62 v108.1,59.33 | v122.73,48.16 124.97,48.16 v125.58,48.77

### Text on the board
tPlace: DNP | DNP | Board Name: Accumulator Main Board / Designed by: Jack Bruford / Date: 15/03/2020 / Version: 1.8